# Altium project Dac8728_Board_v10_modified.PrjPcb
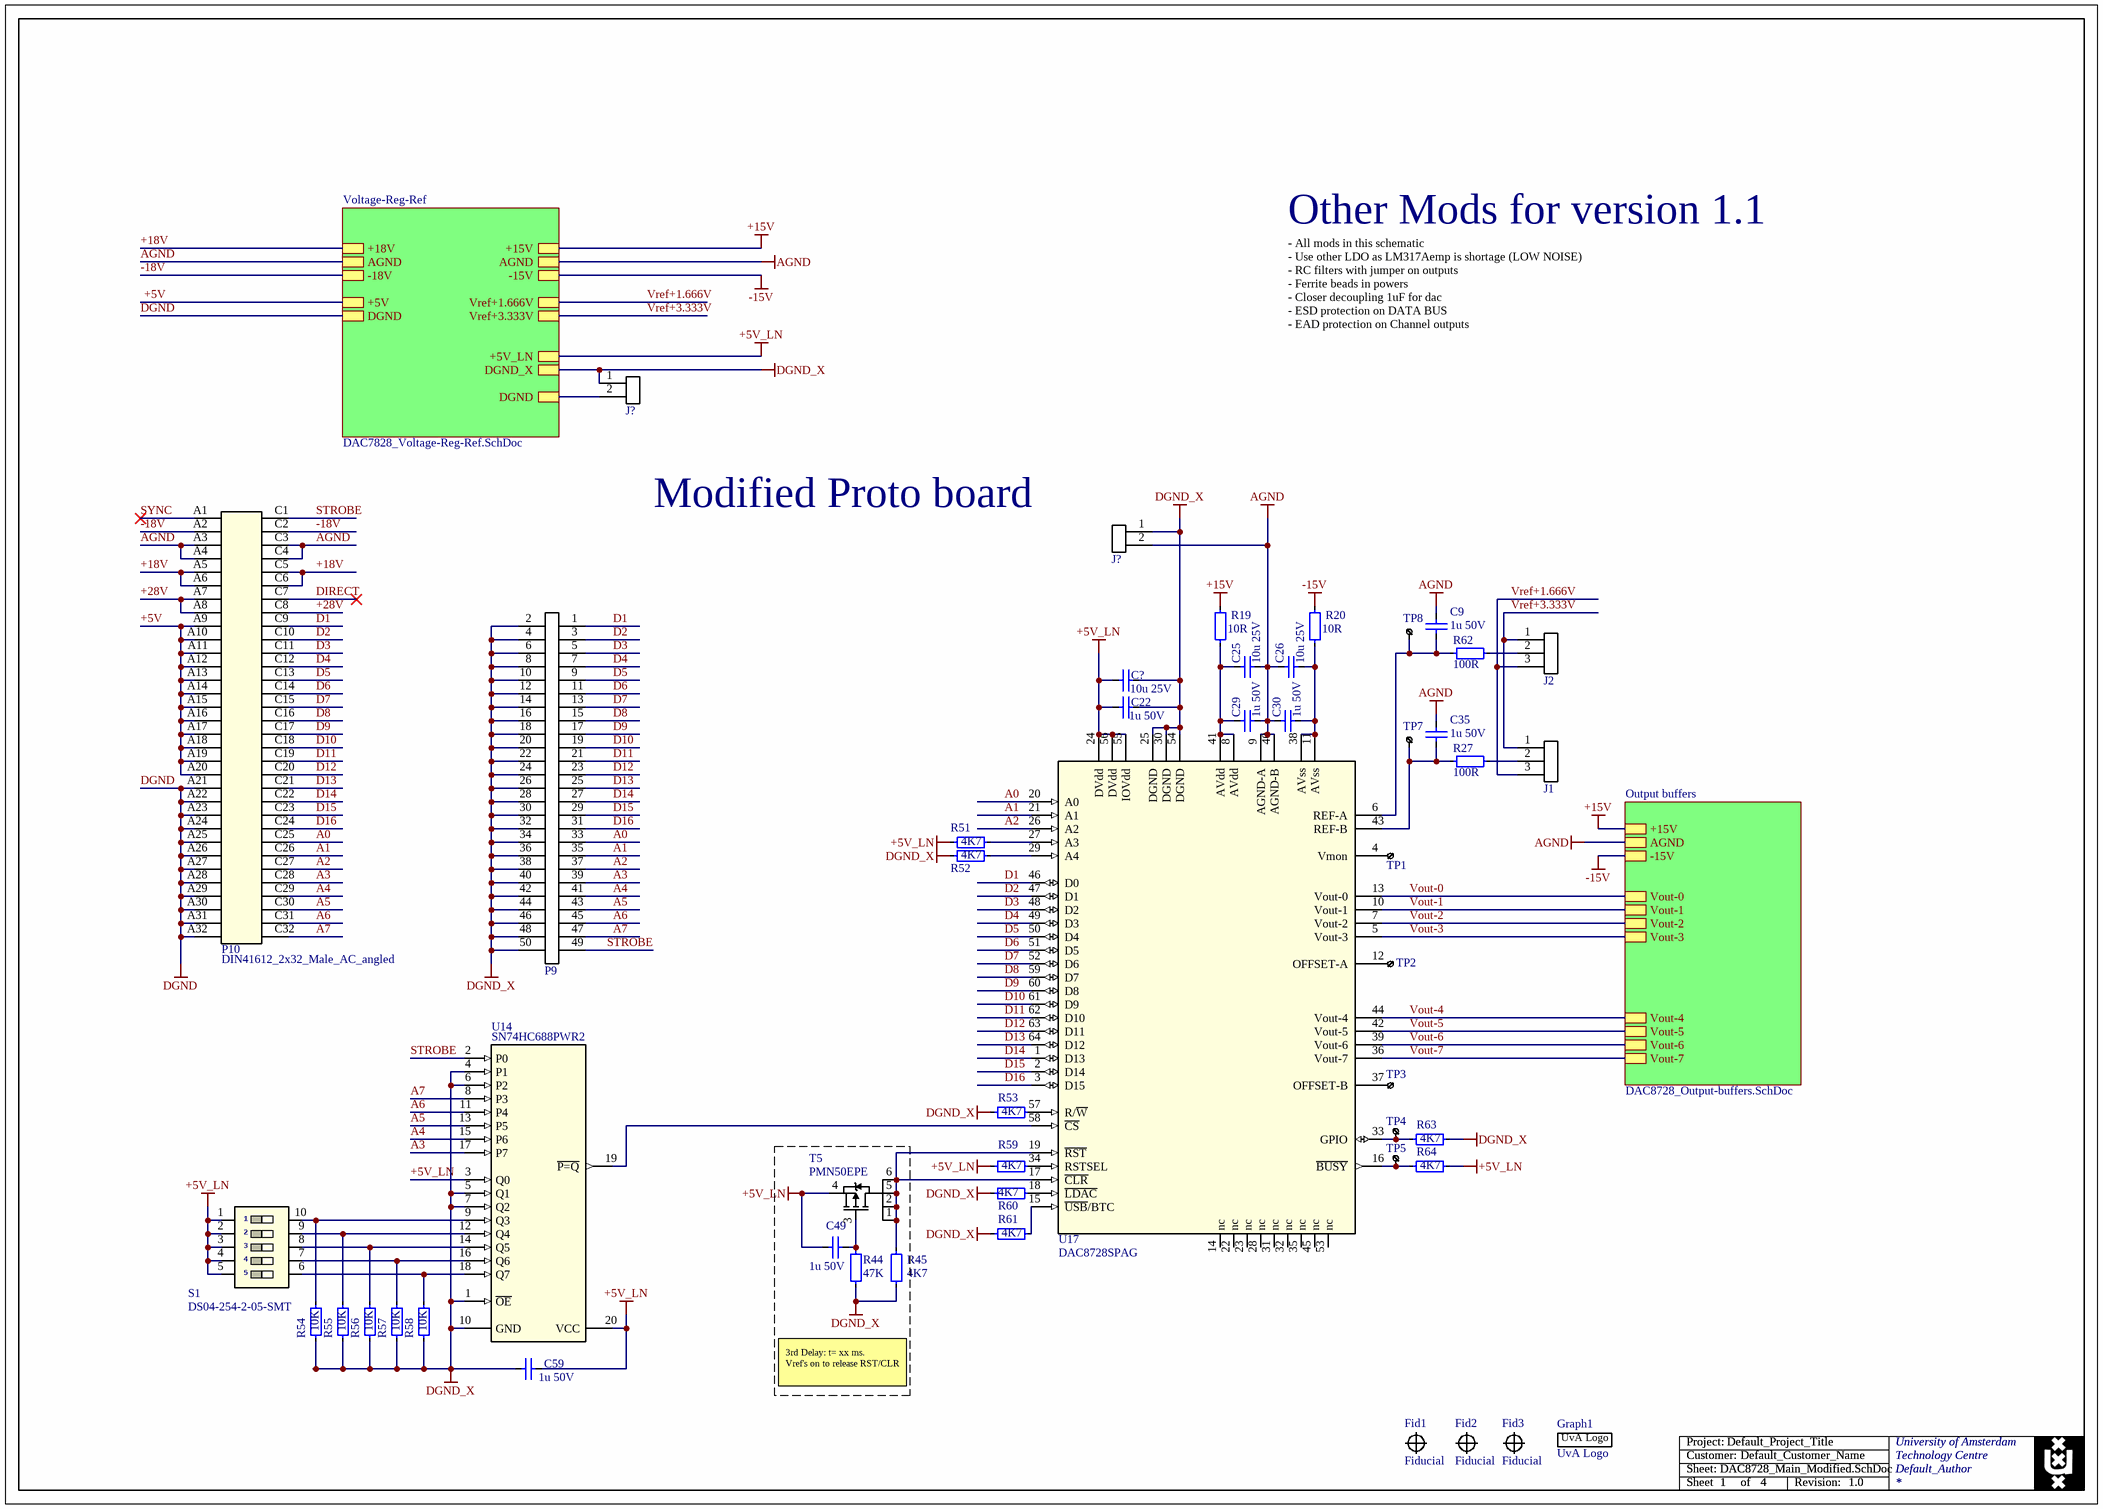
[diagram p0: DAC8728_Main_Modified.SchDoc]
authorname: Default_Author; customer: Default_Customer_Name; projecttitle: Default_Project_Title; revisionnumber: 1.0
4 sheets, 192 parts. Net scope: hierarchical (ports join the sheet entries above them; power ports are global).
Sheets:
  DAC8728_Main_Modified.SchDoc
    Voltage-Reg-Ref = DAC7828_Voltage-Reg-Ref.SchDoc
    Output buffers = DAC8728_Output-buffers.SchDoc
  KladSheet.SchDoc

## Sheet DAC8728_Main_Modified.SchDoc
size A3; Organization: University of Amsterdam; Address1: Technology Centre; DocumentNumber: 1; SheetNumber: 1; SheetTotal: 4

### Parts
(Parts that share a designator on the sheet are numbered #1, #2 ... from top to bottom, then left to right.)
C9  1u 50V  [cap0603MD]
C22  1u 50V  [cap0603MD]
C25  10u 25V  [cap0805MD]
C26  10u 25V  [cap0805MD]
C29  1u 50V  [cap0603MD]
C30  1u 50V  [cap0603MD]
C35  1u 50V  [cap0603MD]
C49  1u 50V  [cap0603MD]
C59  1u 50V  [cap0603MD]
C?#1  10u 25V  [cap0805MD]
Fid1  Fiducial  [fiducial]
Fid2  Fiducial  [fiducial]
Fid3  Fiducial  [fiducial]
Graph1  UvA Logo  [UvA_Logo]
J1  Header 2.54  [Header254-1x3]  (value not drawn)
J2  Header 2.54  [Header254-1x3]  (value not drawn)
J?#1  Header 2.54  [Header254-1x2]  (value not drawn)
J?#2  Header 2.54  [Header254-1x2]  (value not drawn)
P9  Header 2.54  [Header254-2x25]  (value not drawn)
P10  DIN41612_2x32_Male_AC_angled  [DIN41612_2x32_Male_AC_angled]
R19  10R  [res0603MD]
R20  10R  [res0603MD]
R27  100R  [res0603MD]
R44  47K  [res0603MD]
R45  4K7  [res0603MD]
R51  4K7  [res0603MD]
R52  4K7  [res0603MD]
R53  4K7  [res0603MD]
R54  10K  [res0603HD]
R55  10K  [res0603HD]
R56  10K  [res0603HD]
R57  10K  [res0603HD]
R58  10K  [res0603HD]
R59  4K7  [res0603MD]
R60  4K7  [res0603MD]
R61  4K7  [res0603MD]
R62  100R  [res0603MD]
R63  4K7  [res0603MD]
R64  4K7  [res0603MD]
S1  DS04-254-2-05-SMT  [DS04-254-2-05-SMT]
T5  PMN50EPE  [TSOP95P280X110-6N]
TP1  Testpoint  [Testpoint_1mm]  (value not drawn)  (no BOM)
TP2  Testpoint  [Testpoint_1mm]  (value not drawn)  (no BOM)
TP3  Testpoint  [Testpoint_1mm]  (value not drawn)  (no BOM)
TP4  Testpoint  [Testpoint_1mm]  (value not drawn)  (no BOM)
TP5  Testpoint  [Testpoint_1mm]  (value not drawn)  (no BOM)
TP7  Testpoint  [Testpoint_1mm]  (value not drawn)  (no BOM)
TP8  Testpoint  [Testpoint_1mm]  (value not drawn)  (no BOM)
U14  SN74HC688PWR2  [SOIC127P1030X265-20N]
U17  DAC8728SPAG  [TSQFP50P1200X1200X105-64N]

### Sub-sheets
Output buffers = DAC8728_Output-buffers.SchDoc: +15V, AGND, -15V, Vout-1, Vout-2, Vout-3, Vout-4, Vout-5, Vout-6, Vout-7, Vout-0
Voltage-Reg-Ref = DAC7828_Voltage-Reg-Ref.SchDoc: +18V, AGND, -18V, +5V, DGND, +15V, +5V_LN, AGND, -15V, Vref+1.666V, Vref+3.333V, DGND_X, DGND

### Nets
+5V_LN: C22.1 C49.1 C59.2 C?#1.1 R51.1 R59.1 R64.2 S1.1(1a) S1.2(2a) S1.3(3a) S1.4(4a) S1.5(5a) T5.4(S) U14.3(Q0) U14.20(VCC) U17.24(DVdd) U17.55(IOVdd) U17.56(DVdd) ; sheet Voltage-Reg-Ref/+5V_LN
+15V: R19.2 ; sheet Voltage-Reg-Ref/+15V, sheet Output buffers/+15V
-15V: R20.2 ; sheet Voltage-Reg-Ref/-15V, sheet Output buffers/-15V
AGND: C9.2 C25.2 C26.1 C29.1 C30.2 C35.2 J?#2.2 P10.A3 P10.A4 P10.C3 P10.C4 U17.9(AGND-A) U17.40(AGND-B) ; sheet Voltage-Reg-Ref/AGND, sheet Voltage-Reg-Ref/AGND, sheet Output buffers/AGND
DGND: J?#1.2 P10.A21 P10.A22 P10.A23 P10.A24 P10.A25 P10.A26 P10.A27 P10.A28 P10.A29 P10.A30 P10.A31 P10.A32 ; sheet Voltage-Reg-Ref/DGND, sheet Voltage-Reg-Ref/DGND
DGND_X: C22.2 C59.1 C?#1.2 J?#1.1 J?#2.1 P9.2 P9.4 P9.6 P9.8 P9.10 P9.12 P9.14 P9.16 P9.18 P9.20 P9.22 P9.24 P9.26 P9.28 P9.30 P9.32 P9.34 P9.36 P9.38 P9.40 P9.42 P9.44 P9.46 P9.48 P9.50 R44.1 R45.1 R52.1 R53.1 R54.1 R55.1 R56.1 R57.1 R58.1 R60.1 R61.1 R63.2 U14.1(~{OE}) U14.4(P1) U14.5(Q1) U14.6(P2) U14.7(Q2) U14.10(GND) U17.25(DGND) U17.30(DGND) U17.54(DGND) ; sheet Voltage-Reg-Ref/DGND_X
+5V: P10.A9 P10.A10 P10.A11 P10.A12 P10.A13 P10.A14 P10.A15 P10.A16 P10.A17 P10.A18 P10.A19 P10.A20 ; sheet Voltage-Reg-Ref/+5V
+18V: P10.A5 P10.A6 P10.C5 P10.C6 ; sheet Voltage-Reg-Ref/+18V
+28V: P10.A7 P10.A8 P10.C8
-18V: P10.A2 P10.C2 ; sheet Voltage-Reg-Ref/-18V
A0: P9.33 P10.C25 U17.20(A0)
A1: P9.35 P10.C26 U17.21(A1)
A2: P9.37 P10.C27 U17.26(A2)
A3: P9.39 P10.C28 U14.17(P7)
A4: P9.41 P10.C29 U14.15(P6)
A5: P9.43 P10.C30 U14.13(P5)
A6: P9.45 P10.C31 U14.11(P4)
A7: P9.47 P10.C32 U14.8(P3)
D1: P9.1 P10.C9 U17.46(D0)
D2: P9.3 P10.C10 U17.47(D1)
D3: P9.5 P10.C11 U17.48(D2)
D4: P9.7 P10.C12 U17.49(D3)
D5: P9.9 P10.C13 U17.50(D4)
D6: P9.11 P10.C14 U17.51(D5)
D7: P9.13 P10.C15 U17.52(D6)
D8: P9.15 P10.C16 U17.59(D7)
D9: P9.17 P10.C17 U17.60(D8)
D10: P9.19 P10.C18 U17.61(D9)
D11: P9.21 P10.C19 U17.62(D10)
D12: P9.23 P10.C20 U17.63(D11)
D13: P9.25 P10.C21 U17.64(D12)
D14: P9.27 P10.C22 U17.1(D13)
D15: P9.29 P10.C23 U17.2(D14)
D16: P9.31 P10.C24 U17.3(D15)
DIRECT: P10.C7
STROBE: P9.49 P10.C1 U14.2(P0)
SYNC: P10.A1
Vout-0: U17.13(Vout-0) ; sheet Output buffers/Vout-0
Vout-1: U17.10(Vout-1) ; sheet Output buffers/Vout-1
Vout-2: U17.7(Vout-2) ; sheet Output buffers/Vout-2
Vout-3: U17.5(Vout-3) ; sheet Output buffers/Vout-3
Vout-4: U17.44(Vout-4) ; sheet Output buffers/Vout-4
Vout-5: U17.42(Vout-5) ; sheet Output buffers/Vout-5
Vout-6: U17.39(Vout-6) ; sheet Output buffers/Vout-6
Vout-7: U17.36(Vout-7) ; sheet Output buffers/Vout-7
Vref+1.666V: J1.3 J2.3 ; sheet Voltage-Reg-Ref/Vref+1.666V
Vref+3.333V: J1.1 J2.1 ; sheet Voltage-Reg-Ref/Vref+3.333V
NetC9_1: C9.1 R62.1 TP8.1 U17.6(REF-A)
NetC25_1: C25.1 C29.2 R19.1 U17.8(AVdd) U17.41(AVdd)
NetC26_2: C26.2 C30.1 R20.1 U17.11(AVss) U17.38(AVss)
NetC35_1: C35.1 R27.1 TP7.1 U17.43(REF-B)
NetC49_2: C49.2 R44.2 T5.3(G)
NetJ1_2: J1.2 R27.2
NetJ2_2: J2.2 R62.2
NetR45_2: R45.2 T5.1(D) T5.2(D) T5.5(D) T5.6(D) U17.17(~{CLR}) U17.19(~{RST})
NetR51_2: R51.2 U17.27(A3)
NetR52_2: R52.2 U17.29(A4)
NetR53_2: R53.2 U17.57(R/~{W})
NetR54_2: R54.2 S1.10(1b) U14.9(Q3)
NetR55_2: R55.2 S1.9(2b) U14.12(Q4)
NetR56_2: R56.2 S1.8(3b) U14.14(Q5)
NetR57_2: R57.2 S1.7(4b) U14.16(Q6)
NetR58_2: R58.2 S1.6(5b) U14.18(Q7)
NetR59_2: R59.2 U17.34(RSTSEL)
NetR60_2: R60.2 U17.18(~{LDAC})
NetR61_2: R61.2 U17.15(~{USB}/BTC)
NetR63_1: R63.1 TP4.1 U17.33(GPIO)
NetR64_1: R64.1 TP5.1 U17.16(~{BUSY})
NetTP1_1: TP1.1 U17.4(Vmon)
NetTP2_1: TP2.1 U17.12(OFFSET-A)
NetTP3_1: TP3.1 U17.37(OFFSET-B)
NetU14_19: U14.19(~{P=Q}) U17.58(~{CS})

Not connected (* = marked no-connect by the designer): U17 14(nc) 22(nc) 23(nc) 28(nc) 31(nc) 32(nc) 35(nc) 45(nc) 53(nc)

### Notes on the sheet
- Other Mods for version 1.1
- - All mods in this schematic
  - Use other LDO as LM317Aemp is shortage (LOW NOISE)
  - RC filters with jumper on outputs
  - Ferrite beads in powers
  - Closer decoupling 1uF for dac
  - ESD protection on DATA BUS
  - EAD protection on Channel outputs
- (near J?#2) Modified Proto board
- 3rd Delay: t= xx ms.
  Vref's on to release RST/CLR
- Project:
- Customer:
- Sheet
- Sheet:
- of
- Revision:

### Library data of the parts
C9 C22 C29 C30 C35 C49 C59 = Cap0603MD_1u_X5R_50V_10%: id: 123; Precision: 10%; Type: X5R; Author: Twe; Partname: Cap0603MD_1u_X5R_50V_10%; MyComment: 1u 50V; Capacitance: 1u; Supplier 1: Farnell; Supplier Part Number 1: 3013383; CreationDate: 23-Mar-20; Checked by: Unchecked; Voltage: 50V
C25 C26 C?#1 = Cap0805MD_10u_X5R_25V_10%: id: 146; Precision: 10%; Type: 5XR; Author: EB; Partname: Cap0805MD_10u_X5R_25V_10%; MyComment: 10u 25V; Capacitance: 10u; Supplier 1: Farnell; Supplier Part Number 1: 1735530; CreationDate: 31-Mar-16 14:12:18; Checked by: Unchecked; Voltage: 25V
Fid1-Fid3 = Fiducial: id: 1; Author: Twe; Partname: Fiducial; MyComment: Fiducial; Type: Fiducial; Supplier 1: Farnell; CreationDate: 31-Mar-16 09:08:33; Checked by: PCB
Graph1 = UvA_Logo: University of Amsterdam Logo; id: 4; Author: Twe; Partname: UvA_Logo; MyComment: UvA Logo; Type: Logo; Supplier 1: Farnell; CreationDate: 31-Mar-16 13:43:00; Checked by: PCB
J1 J2 = Header254-1x3: Header 2.54p 1x3; id: 33; Author: Twe; Partname: Header254-1x3; MyComment: Header 2.54; Type: Header; Supplier 1: Farnell; Supplier Part Number 1: 1022248; CreationDate: 11-Apr-16 15:00:36; Checked by: PCB
J?#1 J?#2 = Header254-1x2: Header 2.54p 1x2; id: 6; Author: TvR; Partname: Header254-1x2; MyComment: Header 2.54; Type: Header; Supplier 1: Farnell; Supplier Part Number 1: 1022245; CreationDate: 11-Apr-16 15:00:36; Checked by: TvR
P9 = Header254-2x25: Header 2.54p 2x25; Manufacturer: Multicomp; ManufacturerCode: 2213S-50G; id: 146; Author: EB; Partname: Header254-2x25; MyComment: Header 2.54; Type: Header; Supplier 1: Farnell; Supplier Part Number 1: 2847228; CreationDate: 18-Jan-17 13:47:01; Checked by: Unchecked
P10 = DIN41612: Manufacturer: Hartman; id: 144; Author: EB; Partname: DIN41612; MyComment: DIN41612_2x32_Male_AC_angled; Type: Connector; Supplier 1: Farnell; CreationDate: 28-Jun-22 09:22:47; Checked by: Unchecked
R19 R20 = Res0603MD_10R_1%: id: 265; Precision: 1%; Author: Twe; Partname: Res0603MD_10R_1%; MyComment: 10R; Resistance: 10R; Supplier 1: Farnell; Supplier Part Number 1: 2447233; CreationDate: 30-Mar-16 10:33:13; Checked by: Unchecked
R27 R62 = Res0603MD_100R_1%: id: 288; Precision: 1%; Author: TvR; Partname: Res0603MD_100R_1%; MyComment: 100R; Resistance: 100R; Supplier 1: Farnell; Supplier Part Number 1: 1576263; CreationDate: 30-Mar-16 10:33:13; Checked by: Unchecked
R44 = Res0603MD_47K_1%: id: 352; Precision: 1%; Author: Twe; Partname: Res0603MD_47K_1%; MyComment: 47K; Resistance: 47K; Supplier 1: Farnell; Supplier Part Number 1: 2447376; CreationDate: 30-Mar-16 10:33:13; Checked by: Unchecked
R45 R51-R53 R59-R61 R63 R64 = Res0603MD_4K7_1%: id: 328; Precision: 1%; Author: Twe; Partname: Res0603MD_4K7_1%; MyComment: 4K7; Resistance: 4K7; Supplier 1: Farnell; Supplier Part Number 1: 2447385; CreationDate: 30-Mar-16 10:33:13; Checked by: Unchecked
R54-R58 = Res0603HD_10K_1%: id: 534; Precision: 1%; Author: RoKo; Partname: Res0603HD_10K_1%; MyComment: 10K; Resistance: 10K; Supplier 1: Farnell; Supplier Part Number 1: 2446547; CreationDate: 04-Apr-22 10:27:21; Checked by: Unchecked
S1 = DS04-254-2-05-SMT: DIP Switch, 5 SPST, SMD; Manufacturer: CUI Devices; ManufacturerCode: DS04-254-2-05BK-SMT; id: 24; Author: EB; Partname: DS04-254-2-05-SMT; MyComment: DS04-254-2-05-SMT; Type: Switch; Supplier 1: Digi-Key; Supplier Part Number 1: DS04-254-2-05BK-SMT; CreationDate: 05-Jul-22 15:40:19; Checked by: Unchecked
T5 = PMN50EPE: P Channel, MOSFET, -30 V, -6A, 0.045 ohm, SOT457; Manufacturer: NEXPERIA; id: 27; Type: MOSFET P; Author: EB; Partname: PMN50EPE; MyComment: PMN50EPE; ManufacturerCode: PMN50EPE; Supplier 1: Farnell; Supplier Part Number 1: 2900296; CreationDate: 08-Jul-22 12:04:36; Checked by: Unchecked
TP1-TP5 TP7 TP8 = Testpoint_1mm: Testpoint pad 1mm; id: 2; Author: Twe; Partname: Testpoint_1mm; MyComment: Testpoint; Type: Testpoint; Supplier 1: Farnell; CreationDate: 31-Mar-16 13:33:27; Checked by: PCB
U14 = SN74HC688PWR2: 8-Bit Identity Comparators; Manufacturer: Texas Instruments; id: 193; Author: EB; Partname: SN74HC688PWR2; MyComment: SN74HC688PWR2; Type: Logic; ManufacturerCode: SN74HC688PWR2; Supplier 1: Farnell; CreationDate: 12-Jul-22 12:33:51; Checked by: Unchecked
U17 = DAC8728SPAG: Octal, 16-Bit, Low-Power, High-Voltage Output, Parallel Input DAC; Manufacturer: Texas Instruments; id: 185; Author: EB; Partname: DAC8728SPAG; MyComment: DAC8728SPAG; Type: DAC; ManufacturerCode: DAC8728SPAG; Supplier 1: Digi-Key; Supplier Part Number 1: 296-25472-ND; CreationDate: 29-Jun-22 12:22:22; Checked by: Unchecked

## Sheet DAC7828_Voltage-Reg-Ref.SchDoc
size A3; Organization: University of Amsterdam; Address1: Technology Centre; DocumentNumber: 1; SheetNumber: 2; SheetTotal: 4
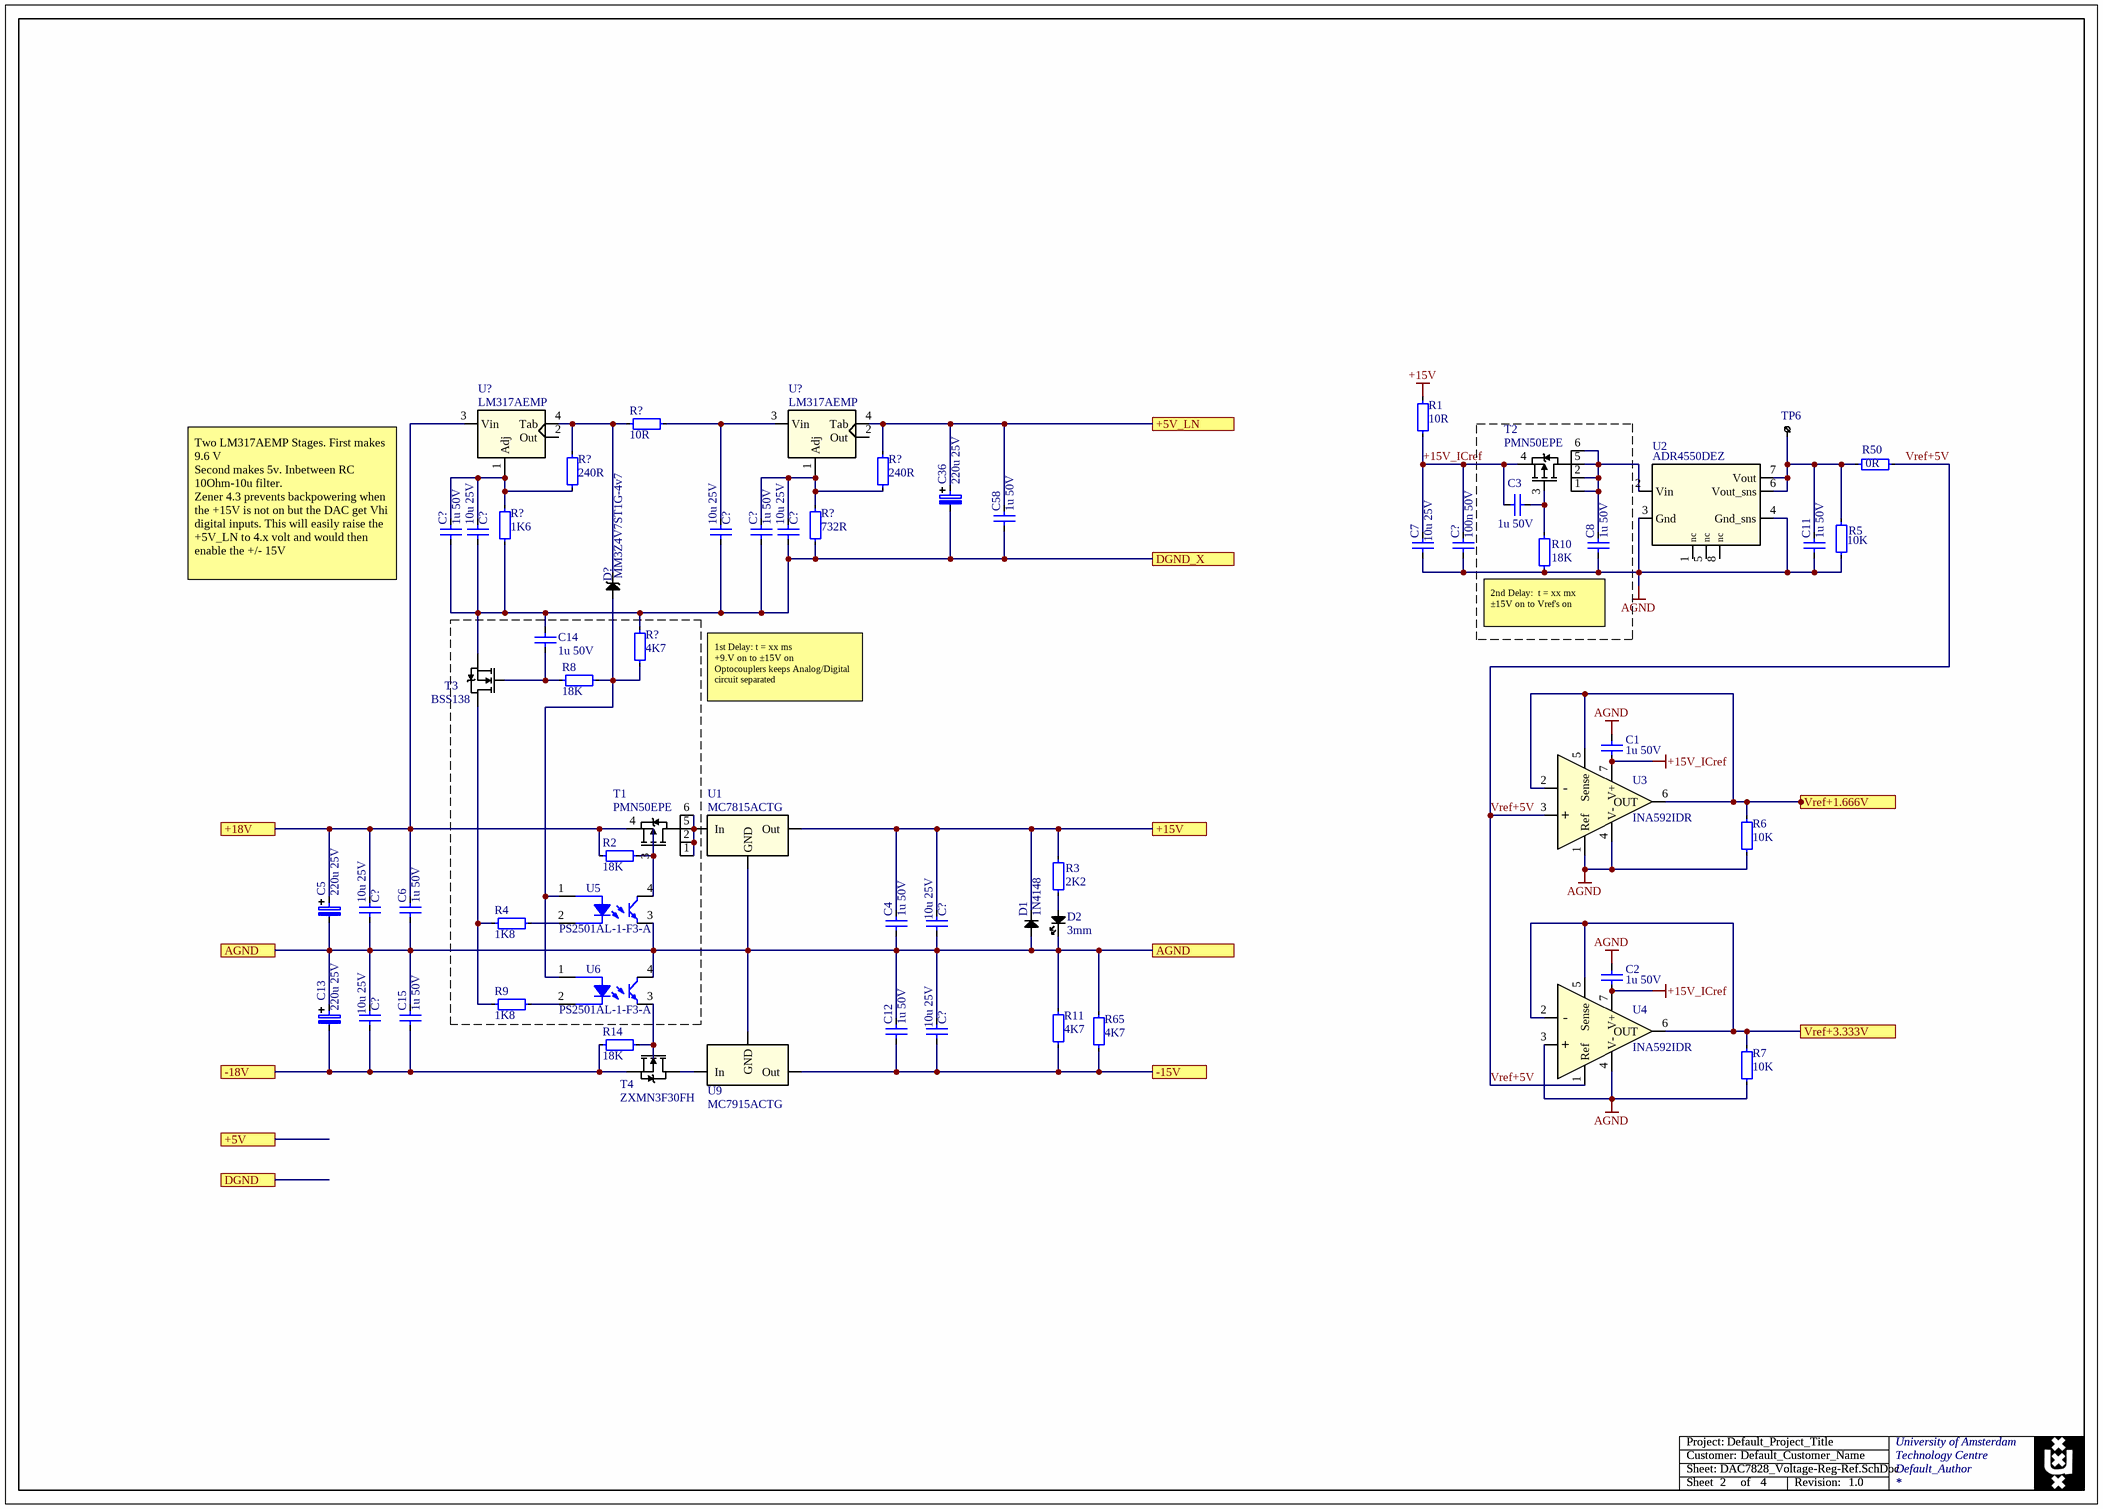
[diagram p1: DAC7828_Voltage-Reg-Ref.SchDoc]

### Parts
(Parts that share a designator on the sheet are numbered #1, #2 ... from top to bottom, then left to right.)
C1  1u 50V  [cap0603MD]
C2  1u 50V  [cap0603MD]
C3  1u 50V  [cap0603MD]
C4  1u 50V  [cap0603MD]
C5  220u 25V  [capAluSmd_d8H10mm]
C6  1u 50V  [cap0603MD]
C7  10u 25V  [cap0805MD]
C8  1u 50V  [cap0603MD]
C11  1u 50V  [cap0603MD]
C12  1u 50V  [cap0603MD]
C13  220u 25V  [capAluSmd_d8H10mm]
C14  1u 50V  [cap0603MD]
C15  1u 50V  [cap0603MD]
C36  220u 25V  [capAluSmd_d8H10mm]
C58  1u 50V  [cap0603MD]
C?#2  1u 50V  [cap0603MD]
C?#3  1u 50V  [cap0603MD]
C?#4  10u 25V  [cap0805MD]
C?#5  10u 25V  [cap0805MD]
C?#6  10u 25V  [cap0805MD]
C?#7  100n 50V  [cap0603MD]
C?#8  10u 25V  [cap0805MD]
C?#9  10u 25V  [cap0805MD]
C?#10  10u 25V  [cap0805MD]
C?#11  10u 25V  [cap0805MD]
D1  1N4148  [SOD2513X100N]
D2  3mm  [LED_3MM_PCB_EDGE_SMD]
D?  MM3Z4V7ST1G-4v7  [SOD-323-2]
R1  10R  [res0603MD]
R2  18K  [res0603MD]
R3  2K2  [res0603MD]
R4  1K8  [res0603MD]
R5  10K  [res0603MD]
R6  10K  [res0603MD]
R7  10K  [res0603MD]
R8  18K  [res0603MD]
R9  1K8  [res0603MD]
R10  18K  [res0603MD]
R11  4K7  [res0603MD]
R14  18K  [res0603MD]
R50  0R  [res0603MD]
R65  4K7  [res0603MD]
R?#1  10R  [res0603MD]
R?#2  240R  [res0603MD]
R?#3  240R  [res0603MD]
R?#4  1K6  [res0603MD]
R?#5  732R  [res0603MD]
R?#6  4K7  [res0603MD]
T1  PMN50EPE  [TSOP95P280X110-6N]
T2  PMN50EPE  [TSOP95P280X110-6N]
T3  BSS138  [SOT95P230X110-3N]
T4  ZXMN3F30FH  [SOT95P230X110-3N]
TP6  Testpoint  [Testpoint_1mm]  (value not drawn)  (no BOM)
U1  MC7815ACTG  [TO220-3_FLAT]
U2  ADR4550DEZ  [LCCS127P503X450X221-8M]
U3  INA592IDR  [SOIC127P600X175-8N]
U4  INA592IDR  [SOIC127P600X175-8N]
U5  PS2501AL-1-F3-A  [SOP254P960X380-4N]
U6  PS2501AL-1-F3-A  [SOP254P960X380-4N]
U9  MC7915ACTG  [TO220-3_FLAT]
U?#1  LM317AEMP  [SOT-223-3P]
U?#2  LM317AEMP  [SOT-223-3P]

### Ports
+5V, +5V_LN, +15V, +18V, -15V, -18V, AGND, DGND, DGND_X, Vref+1.666V, Vref+3.333V

### Nets
+5V_LN: C36.P C58.1 R?#3.2 U?#2.4(Tab) ; port +5V_LN
+15V: C4.1 C?#9.2 D1.1 R1.2 R3.2 U1.3(Out) ; port +15V
+15V_ICref: C1.1 C2.1 C3.1 C7.2 C?#7.2 R1.1 T2.4(S) U3.7(V+) U4.7(V+)
-15V: C12.2 C?#11.1 R11.1 R65.1 U9.3(Out) ; port -15V
AGND: C1.2 C2.2 C4.2 C5.N C6.2 C7.1 C8.2 C11.2 C12.1 C13.P C15.1 C?#7.1 C?#8.1 C?#9.1 C?#10.2 C?#11.2 D1.2 D2.1 R5.1 R6.1 R7.1 R10.1 R11.2 R65.2 U1.2(GND) U2.3(Gnd) U2.4(Gnd_sns) U3.1(Ref) U3.4(V-) U4.3(+) U4.4(V-) U5.3 U6.4 U9.1(GND) ; port AGND
DGND_X: C14.1 C36.N C58.2 C?#2.2 C?#3.2 C?#4.1 C?#5.1 C?#6.1 R?#4.1 R?#5.1 R?#6.2 T3.2(S) ; port DGND_X
+18V: C5.P C6.1 C?#8.2 R2.1 T1.4(S) U?#1.3(Vin) ; port +18V
-18V: C13.N C15.2 C?#10.1 R14.1 T4.2(S) ; port -18V
Vref+1.666V: R6.2 U3.2(-) U3.5(Sense) U3.6(OUT) ; port Vref+1.666V
Vref+3.333V: R7.2 U4.2(-) U4.5(Sense) U4.6(OUT) ; port Vref+3.333V
Vref+5V: R50.2 U3.3(+) U4.1(Ref)
NetC3_2: C3.2 R10.2 T2.3(G)
NetC8_1: C8.1 T2.1(D) T2.2(D) T2.5(D) T2.6(D) U2.2(Vin)
NetC11_1: C11.1 R5.2 R50.1 TP6.1 U2.6(Vout_sns) U2.7(Vout)
NetC14_2: C14.2 R8.2 T3.1(G)
NetC?#2_1: C?#2.1 C?#4.2 R?#2.1 R?#4.2 U?#1.1(Adj)
NetC?#3_1: C?#3.1 C?#6.2 R?#3.1 R?#5.2 U?#2.1(Adj)
NetC?#5_2: C?#5.2 R?#1.2 U?#2.3(Vin)
NetD2_2: D2.2 R3.1
NetD?_A: D?.A R8.1 R?#6.1 U5.1 U6.1
NetD?_C: D?.C R?#1.1 R?#2.2 U?#1.4(Tab)
NetR2_2: R2.2 T1.3(G) U5.4
NetR4_1: R4.1 R9.1 T3.3(D)
NetR4_2: R4.2 U5.2
NetR9_2: R9.2 U6.2
NetR14_2: R14.2 T4.1(G) U6.3
NetT1_1: T1.1(D) T1.2(D) T1.5(D) T1.6(D) U1.1(In)
NetT4_3: T4.3(D) U9.2(In)

Not connected (* = marked no-connect by the designer): U2 1(nc) 5(nc) 8(nc); U?#1 2(Out); U?#2 2(Out)

### Notes on the sheet
- Two LM317AEMP Stages. First makes 9.6 V
  Second makes 5v. Inbetween RC 10Ohm-10u filter.
  Zener 4.3 prevents backpowering when the +15V is not on but the DAC get Vhi digital inputs. This will easily raise the +5V_LN to 4.x volt and would then enable the +/- 15V
- (near R10) 2nd Delay:  t = xx mx
  ±15V on to Vref's on
- 1st Delay: t = xx ms
  +9.V on to ±15V on
  Optocouplers keeps Analog/Digital circuit separated
- Project:
- Customer:
- Sheet
- Sheet:
- of
- Revision:

### Library data of the parts
C1-C4 C6 C8 C11 C12 C14 C15 C58 C?#2 C?#3 = Cap0603MD_1u_X5R_50V_10%: id: 123; Precision: 10%; Type: X5R; Author: Twe; Partname: Cap0603MD_1u_X5R_50V_10%; MyComment: 1u 50V; Capacitance: 1u; Supplier 1: Farnell; Supplier Part Number 1: 3013383; CreationDate: 23-Mar-20; Checked by: Unchecked; Voltage: 50V
C5 C13 C36 = EDK227M025A9MAA: Cap Alu SMD d8h11, ±20%; Manufacturer: Kemet; id: 37; Author: EB; Partname: EDK227M025A9MAA; MyComment: 220u 25V; Capacitance: 220u; Precision: 20%; ManufacturerCode: EDK227M025A9MAA; Supplier 1: Digi-Key; Supplier Part Number 1: 399-18129-1-ND; CreationDate: 06-Jul-22 14:38:19; Checked by: Unchecked; Voltage: 25V
C7 C?#4-C?#6 C?#8-C?#11 = Cap0805MD_10u_X5R_25V_10%: id: 146; Precision: 10%; Type: 5XR; Author: EB; Partname: Cap0805MD_10u_X5R_25V_10%; MyComment: 10u 25V; Capacitance: 10u; Supplier 1: Farnell; Supplier Part Number 1: 1735530; CreationDate: 31-Mar-16 14:12:18; Checked by: Unchecked; Voltage: 25V
C?#7 = Cap0603MD_100n_X7R_50V_10%: id: 12; Precision: 10%; Type: X7R; Author: TvR; Partname: Cap0603MD_100n_X7R_50V_10%; MyComment: 100n 50V; Capacitance: 100n; Supplier 1: Farnell; Supplier Part Number 1: 2581046; CreationDate: 31-Mar-16 14:01:33; Checked by: Unchecked; Voltage: 50V
D1 = 1N4148WS: Small Signal Diode, Single, 100 V, 150 mA, 1 V, 4 ns, 350 mA; Manufacturer: Multicomp; id: 15; Type: General Purpose; Author: Twe; Partname: 1N4148WS; MyComment: 1N4148; ManufacturerCode: 1N4148WS; Supplier 1: Farnell; Supplier Part Number 1: 1466524; CreationDate: 26-Aug-16 13:43:40; Checked by: PCB
D2 = LED_3mm_PcbEdgeSmd: Generic 3mm LED Footprint PCB Edge SMD Pads; id: 40; Author: EB; Partname: LED_3mm_PcbEdgeSmd; MyComment: 3mm; Type: LED; Supplier 1: Farnell; CreationDate: 26-May-16 08:35:38; Checked by: Unchecked
D? = MM3Z4V7ST1G: Zener 4v7, 300 mW, SOD−323; Manufacturer: On Semiconductor; id: 41; Author: EB; Partname: MM3Z4V7ST1G; MyComment: MM3Z4V7ST1G-4v7; Type: Zener; ManufacturerCode: MM3Z4V7ST1G; Supplier 1: Farnell; Supplier Part Number 1: 2463512; CreationDate: 13-Oct-22 10:49:01; Checked by: Unchecked
R1 R?#1 = Res0603MD_10R_1%: id: 265; Precision: 1%; Author: Twe; Partname: Res0603MD_10R_1%; MyComment: 10R; Resistance: 10R; Supplier 1: Farnell; Supplier Part Number 1: 2447233; CreationDate: 30-Mar-16 10:33:13; Checked by: Unchecked
R2 R8 R10 R14 = Res0603MD_18K_1%: id: 342; Precision: 1%; Author: Twe; Partname: Res0603MD_18K_1%; MyComment: 18K; Resistance: 18K; Supplier 1: Farnell; Supplier Part Number 1: 9330720; CreationDate: 30-Mar-16 10:33:13; Checked by: Unchecked
R3 = Res0603MD_2K2_1%: id: 320; Precision: 1%; Author: Twe; Partname: Res0603MD_2K2_1%; MyComment: 2K2; Resistance: 2K2; Supplier 1: Farnell; Supplier Part Number 1: 9330810; CreationDate: 30-Mar-16 10:33:13; Checked by: Unchecked
R4 R9 = Res0603MD_1K8_1%: id: 318; Precision: 1%; Author: Twe; Partname: Res0603MD_1K8_1%; MyComment: 1K8; Resistance: 1K8; Supplier 1: Farnell; Supplier Part Number 1: 9330712; CreationDate: 30-Mar-16 10:33:13; Checked by: Unchecked
R5-R7 = Res0603MD_10K_1%: id: 336; Precision: 1%; Author: TvR; Partname: Res0603MD_10K_1%; MyComment: 10K; Resistance: 10K; Supplier 1: Farnell; Supplier Part Number 1: 2446547; CreationDate: 30-Mar-16 10:33:13; Checked by: Unchecked
R11 R65 R?#6 = Res0603MD_4K7_1%: id: 328; Precision: 1%; Author: Twe; Partname: Res0603MD_4K7_1%; MyComment: 4K7; Resistance: 4K7; Supplier 1: Farnell; Supplier Part Number 1: 2447385; CreationDate: 30-Mar-16 10:33:13; Checked by: Unchecked
R50 = Res0603MD_0R_1%: id: 264; Precision: 1%; Author: Twe; Partname: Res0603MD_0R_1%; MyComment: 0R; Resistance: 0R; Supplier 1: Farnell; Supplier Part Number 1: 2447743; CreationDate: 30-Mar-16 10:33:13; Checked by: Unchecked
R?#2 R?#3 = Res0603MD_240R_1%: id: 297; Precision: 1%; Author: Twe; Partname: Res0603MD_240R_1%; MyComment: 240R; Resistance: 240R; Supplier 1: Farnell; Supplier Part Number 1: 9330860; CreationDate: 30-Mar-16 10:33:13; Checked by: Unchecked
R?#4 = Res0603MD_1K6_1%: id: 317; Precision: 1%; Author: Twe; Partname: Res0603MD_1K6_1%; MyComment: 1K6; Resistance: 1K6; Supplier 1: Farnell; Supplier Part Number 1: 9330666; CreationDate: 30-Mar-16 10:33:13; Checked by: Unchecked
R?#5 = Res0603MD_7320R_1%: id: 537; Precision: 1%; Author: Twe; Partname: Res0603MD_7320R_1%; MyComment: 732R; Resistance: 732R; Supplier 1: Farnell; Supplier Part Number 1: 9331506; CreationDate: 30-Mar-16 10:33:13; Checked by: Unchecked
T1 T2 = PMN50EPE: as T5 on sheet DAC8728_Main_Modified; Author: EB; Partname: PMN50EPE; MyComment: PMN50EPE; ManufacturerCode: PMN50EPE; Supplier 1: Farnell; Supplier Part Number 1: 2900296; CreationDate: 08-Jul-22 12:04:36; Checked by: Unchecked
T3 = BSS138: N-Channel Logic Level Enhancement, 3R5; Manufacturer: ON Semi; id: 20; Type: MOSFET EN; Author: TvR; Partname: BSS138; MyComment: BSS138; ManufacturerCode: BSS138; Supplier 1: Farnell; Supplier Part Number 1: 9845330; CreationDate: 20-May-19 16:27:00; Checked by: Unchecked
T4 = ZXMN3F30FH: MOSFET Transistor, N Channel, 4.6 A, 30 V, 65 mohm, 4.5Vgs; Manufacturer: ZETEX; id: 26; Type: MOSFET N; Author: EB; Partname: ZXMN3F30FH; MyComment: ZXMN3F30FH; ManufacturerCode: ZXMN3F30FH; Supplier 1: Farnell; Supplier Part Number 1: 1583667; CreationDate: 07-Jul-22 12:16:34; Checked by: Unchecked
TP6 = Testpoint_1mm: Testpoint pad 1mm; id: 2; Author: Twe; Partname: Testpoint_1mm; MyComment: Testpoint; Type: Testpoint; Supplier 1: Farnell; CreationDate: 31-Mar-16 13:33:27; Checked by: PCB
U1 = MC7815ACTG_Flat: Linear Voltage Regulator,Positive, Fixed, 35V In, 15V And 1A Out; Manufacturer: OnSEMI; id: 191; Author: EB; Partname: MC7815ACTG_Flat; MyComment: MC7815ACTG; Type: Power; ManufacturerCode: MC7815ACTG; Supplier 1: Digi-Key; CreationDate: 06-Jul-22 13:15:49; Checked by: Unchecked
U2 = ADR4550DEZ: Ultralow Noise, High Accuracy / Voltage References; Manufacturer: Analog Devices; id: 187; Author: EB; Partname: ADR4550DEZ; MyComment: ADR4550DEZ; Type: Voltage Reference; ManufacturerCode: ADR4550DEZ; Supplier 1: Digi-Key; Supplier Part Number 1: 505-ADR4550DEZ-ND; CreationDate: 04-Jul-22 15:46:48; Checked by: Unchecked
U3 U4 = INA592IDR: INA592 High-Precision, Wide-Bandwidth e-trim™ Difference Amplifier; Manufacturer: Texas Instruments; id: 186; Partname: INA592IDR; MyComment: INA592IDR; Type: Opamp; ManufacturerCode: INA592IDR; Supplier 1: Digi-Key; Supplier Part Number 1: 296-INA592IDRCT-ND; Author: EB; CreationDate: 04-Jul-22 14:48:50; Checked by: Unchecked
U5 U6 = PS2501AL-1-F3-A: Optocoupler 1ch, Vceo=70V, Ic=30mA, CTR=200-400% @ 5mA; Manufacturer: CEL; id: 28; Partname: PS2501AL-1-F3-A; MyComment: PS2501AL-1-F3-A; Type: OptoCoupler; ManufacturerCode: PS2501AL-1-F3-A; Supplier 1: Farnell; Supplier Part Number 1: 3605298; Author: EB; CreationDate: 11-Jul-22 09:21:13; Checked by: Unchecked
U9 = MC7915ACTG_Flat: Linear Voltage Regulator,Negative, Fixed, -35V In, -15V And -1A Out; Manufacturer: OnSEMI; id: 192; Author: EB; Partname: MC7915ACTG_Flat; MyComment: MC7915ACTG; Type: Power; ManufacturerCode: MC7915ACTG; Supplier 1: Digi-Key; CreationDate: 06-Jul-22 13:25:15; Checked by: Unchecked
U?#1 U?#2 = LM317AEMP: LM317A 1% Accurate 1.5A Adjustable Voltage Regulator 1.25-37V; Manufacturer: Texas Instruments; ManufacturerCode: LM371AEMP; id: 199; Author: EB; Partname: LM317AEMP; MyComment: LM317AEMP; Type: Voltage Regulator; Supplier 1: Mouser; Supplier Part Number 1: 926-LM317AEMP/NOPB; CreationDate: 06-Aug-21 14:07:49; Checked by: Unchecked

## Sheet DAC8728_Output-buffers.SchDoc
size A3; Organization: University of Amsterdam; Address1: Technology Centre; DocumentNumber: 1; SheetNumber: 3; SheetTotal: 4
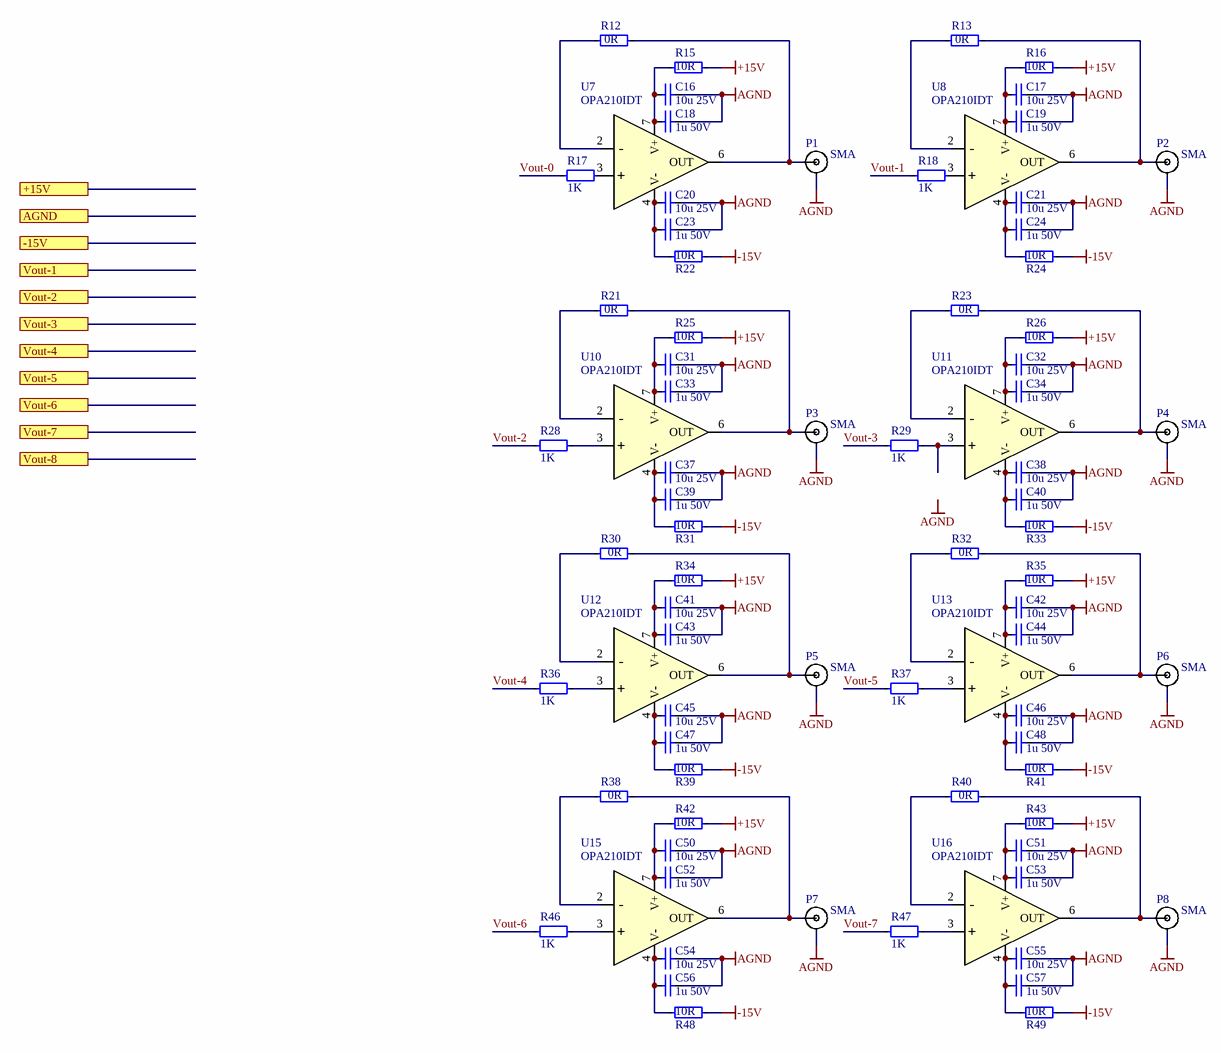
[diagram p2: DAC8728_Output-buffers.SchDoc]

### Parts
C16  10u 25V  [cap0805MD]
C17  10u 25V  [cap0805MD]
C18  1u 50V  [cap0603MD]
C19  1u 50V  [cap0603MD]
C20  10u 25V  [cap0805MD]
C21  10u 25V  [cap0805MD]
C23  1u 50V  [cap0603MD]
C24  1u 50V  [cap0603MD]
C31  10u 25V  [cap0805MD]
C32  10u 25V  [cap0805MD]
C33  1u 50V  [cap0603MD]
C34  1u 50V  [cap0603MD]
C37  10u 25V  [cap0805MD]
C38  10u 25V  [cap0805MD]
C39  1u 50V  [cap0603MD]
C40  1u 50V  [cap0603MD]
C41  10u 25V  [cap0805MD]
C42  10u 25V  [cap0805MD]
C43  1u 50V  [cap0603MD]
C44  1u 50V  [cap0603MD]
C45  10u 25V  [cap0805MD]
C46  10u 25V  [cap0805MD]
C47  1u 50V  [cap0603MD]
C48  1u 50V  [cap0603MD]
C50  10u 25V  [cap0805MD]
C51  10u 25V  [cap0805MD]
C52  1u 50V  [cap0603MD]
C53  1u 50V  [cap0603MD]
C54  10u 25V  [cap0805MD]
C55  10u 25V  [cap0805MD]
C56  1u 50V  [cap0603MD]
C57  1u 50V  [cap0603MD]
P1  SMA  [619540-1]
P2  SMA  [619540-1]
P3  SMA  [619540-1]
P4  SMA  [619540-1]
P5  SMA  [619540-1]
P6  SMA  [619540-1]
P7  SMA  [619540-1]
P8  SMA  [619540-1]
R12  0R  [res0603MD]
R13  0R  [res0603MD]
R15  10R  [res0603MD]
R16  10R  [res0603MD]
R17  1K  [res0603MD]
R18  1K  [res0603MD]
R21  0R  [res0603MD]
R22  10R  [res0603MD]
R23  0R  [res0603MD]
R24  10R  [res0603MD]
R25  10R  [res0603MD]
R26  10R  [res0603MD]
R28  1K  [res0603MD]
R29  1K  [res0603MD]
R30  0R  [res0603MD]
R31  10R  [res0603MD]
R32  0R  [res0603MD]
R33  10R  [res0603MD]
R34  10R  [res0603MD]
R35  10R  [res0603MD]
R36  1K  [res0603MD]
R37  1K  [res0603MD]
R38  0R  [res0603MD]
R39  10R  [res0603MD]
R40  0R  [res0603MD]
R41  10R  [res0603MD]
R42  10R  [res0603MD]
R43  10R  [res0603MD]
R46  1K  [res0603MD]
R47  1K  [res0603MD]
R48  10R  [res0603MD]
R49  10R  [res0603MD]
U7  OPA210IDT  [SOIC127P600X175-8N]
U8  OPA210IDT  [SOIC127P600X175-8N]
U10  OPA210IDT  [SOIC127P600X175-8N]
U11  OPA210IDT  [SOIC127P600X175-8N]
U12  OPA210IDT  [SOIC127P600X175-8N]
U13  OPA210IDT  [SOIC127P600X175-8N]
U15  OPA210IDT  [SOIC127P600X175-8N]
U16  OPA210IDT  [SOIC127P600X175-8N]

### Ports
+15V, -15V, AGND, Vout-1, Vout-2, Vout-3, Vout-4, Vout-5, Vout-6, Vout-7, Vout-8

### Nets
+15V: R15.1 R16.1 R25.1 R26.1 R34.1 R35.1 R42.1 R43.1 ; port +15V
-15V: R22.1 R24.1 R31.1 R33.1 R39.1 R41.1 R48.1 R49.1 ; port -15V
AGND: C16.2 C17.2 C18.2 C19.2 C20.2 C21.2 C23.2 C24.2 C31.2 C32.2 C33.2 C34.2 C37.2 C38.2 C39.2 C40.2 C41.2 C42.2 C43.2 C44.2 C45.2 C46.2 C47.2 C48.2 C50.2 C51.2 C52.2 C53.2 C54.2 C55.2 C56.2 C57.2 P1.2 P2.2 P3.2 P4.2 P5.2 P6.2 P7.2 P8.2 ; port AGND
Vout-0: R17.1
Vout-1: R18.1
Vout-2: R28.1
Vout-3: R29.1
Vout-4: R36.1
Vout-5: R37.1
Vout-6: R46.1
Vout-7: R47.1
NetC16_1: C16.1 C18.1 R15.2 U7.7(V+)
NetC17_1: C17.1 C19.1 R16.2 U8.7(V+)
NetC20_1: C20.1 C23.1 R22.2 U7.4(V-)
NetC21_1: C21.1 C24.1 R24.2 U8.4(V-)
NetC31_1: C31.1 C33.1 R25.2 U10.7(V+)
NetC32_1: C32.1 C34.1 R26.2 U11.7(V+)
NetC37_1: C37.1 C39.1 R31.2 U10.4(V-)
NetC38_1: C38.1 C40.1 R33.2 U11.4(V-)
NetC41_1: C41.1 C43.1 R34.2 U12.7(V+)
NetC42_1: C42.1 C44.1 R35.2 U13.7(V+)
NetC45_1: C45.1 C47.1 R39.2 U12.4(V-)
NetC46_1: C46.1 C48.1 R41.2 U13.4(V-)
NetC50_1: C50.1 C52.1 R42.2 U15.7(V+)
NetC51_1: C51.1 C53.1 R43.2 U16.7(V+)
NetC54_1: C54.1 C56.1 R48.2 U15.4(V-)
NetC55_1: C55.1 C57.1 R49.2 U16.4(V-)
NetP1_1: P1.1 R12.2 U7.6(OUT)
NetP2_1: P2.1 R13.2 U8.6(OUT)
NetP3_1: P3.1 R21.2 U10.6(OUT)
NetP4_1: P4.1 R23.2 U11.6(OUT)
NetP5_1: P5.1 R30.2 U12.6(OUT)
NetP6_1: P6.1 R32.2 U13.6(OUT)
NetP7_1: P7.1 R38.2 U15.6(OUT)
NetP8_1: P8.1 R40.2 U16.6(OUT)
NetR12_1: R12.1 U7.2(-)
NetR13_1: R13.1 U8.2(-)
NetR17_2: R17.2 U7.3(+)
NetR18_2: R18.2 U8.3(+)
NetR21_1: R21.1 U10.2(-)
NetR23_1: R23.1 U11.2(-)
NetR28_2: R28.2 U10.3(+)
NetR29_2: R29.2 U11.3(+)
NetR30_1: R30.1 U12.2(-)
NetR32_1: R32.1 U13.2(-)
NetR36_2: R36.2 U12.3(+)
NetR37_2: R37.2 U13.3(+)
NetR38_1: R38.1 U15.2(-)
NetR40_1: R40.1 U16.2(-)
NetR46_2: R46.2 U15.3(+)
NetR47_2: R47.2 U16.3(+)

### Notes on the sheet
- Labels drawn without touching a wire or pin: AGND
- Project:
- Customer:
- Sheet
- Sheet:
- of
- Revision:

### Library data of the parts
C16 C17 C20 C21 C31 C32 C37 C38 C41 C42 C45 C46 C50 C51 C54 C55 = Cap0805MD_10u_X5R_25V_10%: id: 146; Precision: 10%; Type: 5XR; Author: EB; Partname: Cap0805MD_10u_X5R_25V_10%; MyComment: 10u 25V; Capacitance: 10u; Supplier 1: Farnell; Supplier Part Number 1: 1735530; CreationDate: 31-Mar-16 14:12:18; Checked by: Unchecked; Voltage: 25V
  C16 C20: ClassName: OutBufClass0
  C17 C21: ClassName: OutBufClass1
C18 C19 C23 C24 C33 C34 C39 C40 C43 C44 C47 C48 C52 C53 C56 C57 = Cap0603MD_1u_X5R_50V_10%: id: 123; Precision: 10%; Type: X5R; Author: Twe; Partname: Cap0603MD_1u_X5R_50V_10%; MyComment: 1u 50V; Capacitance: 1u; Supplier 1: Farnell; Supplier Part Number 1: 3013383; CreationDate: 23-Mar-20; Checked by: Unchecked; Voltage: 50V
  C18 C23: ClassName: OutBufClass0
  C19 C24: ClassName: OutBufClass1
P1-P8 = 619540-1: SMA right angle through hole, 19mm, 50 Ohm; Manufacturer: TE connectivity; id: 145; Author: EB; Partname: 619540-1; MyComment: SMA; Type: SMA; ManufacturerCode: 619540-1; Supplier 1: Farnell; Supplier Part Number 1: 3133848; CreationDate: 31-Mar-16 12:11:50; Checked by: Unchecked
R12 R13 R21 R23 R30 R32 R38 R40 = Res0603MD_0R_1%: id: 264; Precision: 1%; Author: Twe; Partname: Res0603MD_0R_1%; MyComment: 0R; Resistance: 0R; Supplier 1: Farnell; Supplier Part Number 1: 2447743; CreationDate: 30-Mar-16 10:33:13; Checked by: Unchecked
R15 R16 R22 R24-R26 R31 R33-R35 R39 R41-R43 R48 R49 = Res0603MD_10R_1%: id: 265; Precision: 1%; Author: Twe; Partname: Res0603MD_10R_1%; MyComment: 10R; Resistance: 10R; Supplier 1: Farnell; Supplier Part Number 1: 2447233; CreationDate: 30-Mar-16 10:33:13; Checked by: Unchecked
R17 R18 R28 R29 R36 R37 R46 R47 = Res0603MD_1K_1%: id: 312; Precision: 1%; Author: Twe; Partname: Res0603MD_1K_1%; MyComment: 1K; Resistance: 1K; Supplier 1: Farnell; Supplier Part Number 1: 2447272; CreationDate: 30-Mar-16 10:33:13; Checked by: Unchecked
U7 U8 U10-U13 U15 U16 = OPA210IDT: UltraLow Noise-drift, high precision, Low-Power, 36-V; Manufacturer: Analog Devices; id: 194; Partname: OPA210IDT; MyComment: OPA210IDT; Type: OpAmp; ManufacturerCode: OPA210IDT; Supplier 1: Mouser; Supplier Part Number 1: 595-OPA210IDT; Author: EB; CreationDate: 05-Jul-22 13:39:52; Checked by: Unchecked

## Sheet KladSheet.SchDoc
size A3; Organization: University of Amsterdam; Address1: Technology Centre; DocumentNumber: 1; SheetNumber: 4; SheetTotal: 4

### Notes on the sheet
- Project:
- Customer:
- Sheet
- Sheet:
- of
- Revision:

## Nets that join several sheets
+5V_LN: DAC8728_Main_Modified (18 pins), DAC7828_Voltage-Reg-Ref (C36.P C58.1 R?#3.2 U?#2.4)
+15V: DAC8728_Main_Modified (R19.2), DAC7828_Voltage-Reg-Ref (6 pins), DAC8728_Output-buffers (8 pins)
-15V: DAC8728_Main_Modified (R20.2), DAC7828_Voltage-Reg-Ref (5 pins), DAC8728_Output-buffers (8 pins)
AGND: DAC8728_Main_Modified (13 pins), DAC7828_Voltage-Reg-Ref (34 pins), DAC8728_Output-buffers (40 pins)
DGND_X: DAC8728_Main_Modified (51 pins), DAC7828_Voltage-Reg-Ref (12 pins)
+18V: DAC8728_Main_Modified (P10.A5 P10.A6 P10.C5 P10.C6), DAC7828_Voltage-Reg-Ref (6 pins)
-18V: DAC8728_Main_Modified (P10.A2 P10.C2), DAC7828_Voltage-Reg-Ref (5 pins)
Vref+1.666V: DAC8728_Main_Modified (J1.3 J2.3), DAC7828_Voltage-Reg-Ref (R6.2 U3.2 U3.5 U3.6)
Vref+3.333V: DAC8728_Main_Modified (J1.1 J2.1), DAC7828_Voltage-Reg-Ref (R7.2 U4.2 U4.5 U4.6)